# EAGLE design clock_src2 (EAGLE 7.7.0)
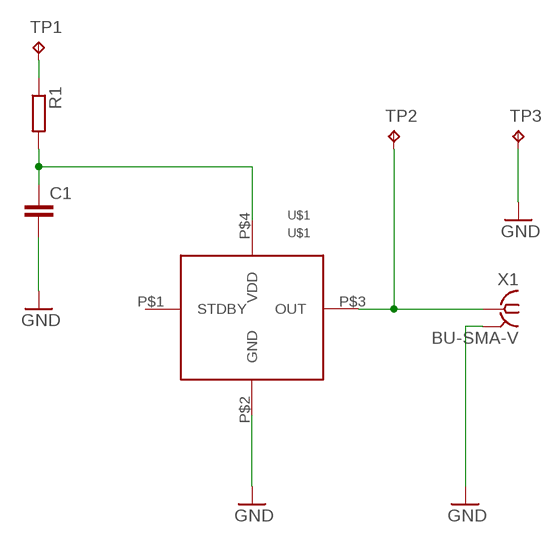
[diagram p0: schematic, sheet 1]

## Parts
C1  C-EUC0603  [C0603]
R1  R-EU_R0603  [R0603]
TP1  TPTP20SQ  [TP20SQ]
TP2  TPTP20SQ  [TP20SQ]
TP3  TPTP20SQ  [TP20SQ]
U$1  ASFLMB-24525  [ASFLMB-24525]
X1  BU-SMA-V  [BU-SMA-V]

## Nets
GND: C1.2 TP3.TP U$1.P$2(GND) X1.2 X1.3 X1.4 X1.5
N$1: TP2.TP U$1.P$3(OUT) X1.1
N$2: R1.1 TP1.TP
N$3: C1.1 R1.2 U$1.P$4(VDD)
Unconnected: U$1.P$1(STDBY)

## Library data of the parts
C1 = resistor:C-EU: CAPACITOR, European symbol
R1 = resistor:R-EU_: RESISTOR, European symbol
TP1-TP3 = testpad:TP: Test pad
U$1 = FM_transmitter:ASFLMB-24525
X1 = con-coax:BU-SMA-V: FEMALE SMA CONNECTOR Radiall distributor RS 112-3794; OC_FARNELL: unknown; OC_NEWARK: unknown

## Board
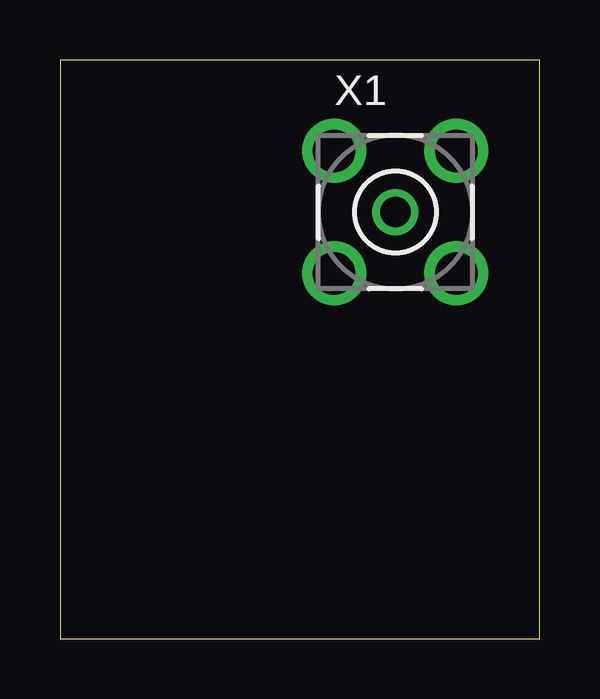
[diagram p1: board, top side]
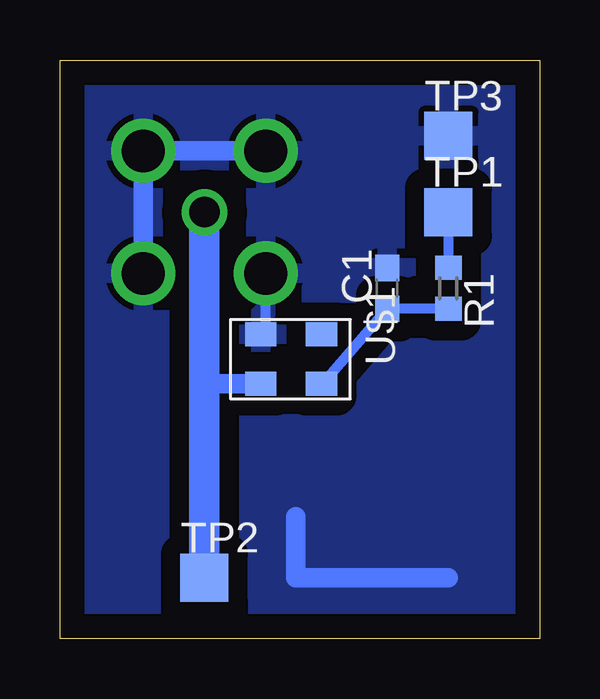
[diagram p2: board, bottom side, seen from below]

Size 19.99 x 24.12 mm. Coordinates in mm from the lower left corner, seen from the top.
Outline: 0,0 19.99,0 19.99,24.12 0,24.12 0,0
Copper layers (1*16): Top 0.035mm / dielectric 1.5mm / Bottom 0.035mm
Design rules "default": minimum track width 10mil, minimum drill 24mil, track to track 8mil, track to pad 8mil, pad to pad 8mil, via to via 8mil, smd to smd 8mil, copper to edge 40mil, drill to drill 8mil, minimum pad ring 10mil, minimum via ring 8mil, stop-mask expansion 4mil, vias tented up to drill 0mil, thermal gap 10mil

### Footprints (pad centres in the part's own frame; a part is rotated, then mirrored left to right if it is on the bottom)
C0603 = smd 1.1 x 1: 1 -0.85,0; 2 0.85,0
R0603 = smd 1 x 1.1: 1 -0.85,0; 2 0.85,0
TP20SQ = smd 2 x 2: TP 0,0
ASFLMB-24525 = smd 1.3 x 1: P$1 0.2,0; P$2 2.74,0; P$3 2.74,2.07; P$4 0.2,2.07
BU-SMA-V = drill 1.27: 1 0,0 | drill 1.778: 2 -2.55,2.55; 3 2.55,2.55; 4 2.55,-2.55; 5 -2.55,-2.55

### Placement (x,y rotation side)
C1  6.35,14.61 90 bottom
R1  3.81,14.61 270 bottom
TP1  3.81,17.78 0 bottom
TP2  13.97,2.54 0 bottom
TP3  3.81,20.95 0 bottom
U$1  8.89,12.7 180 bottom
X1  13.97,17.78 0 top

### Tracks (layer width: path | path; a pad name or v marks a point on that pad's centre or on a via)
GND
  Bottom 0.406: U$1.P$2 11.42,12.7 X1.5
  Bottom 0.813: X1.4 X1.3 X1.2 | X1.4 | X1.4 | 3.81,2.54 10.16,2.54 10.16,5.08
  pour Bottom (isolate 0.813): 1.27,22.86 1.27,1.27 19.05,1.27 19.05,22.86
N$1
  Bottom 0.813: U$1.P$3 13.97,10.63 13.97,10.16
  Bottom 1.27: TP2.TP 13.97,10.16 X1.1
N$2
  Bottom 0.406: TP1.TP R1.1
N$3
  Bottom 0.406: U$1.P$4 9.09,10.58 C1.1 R1.2